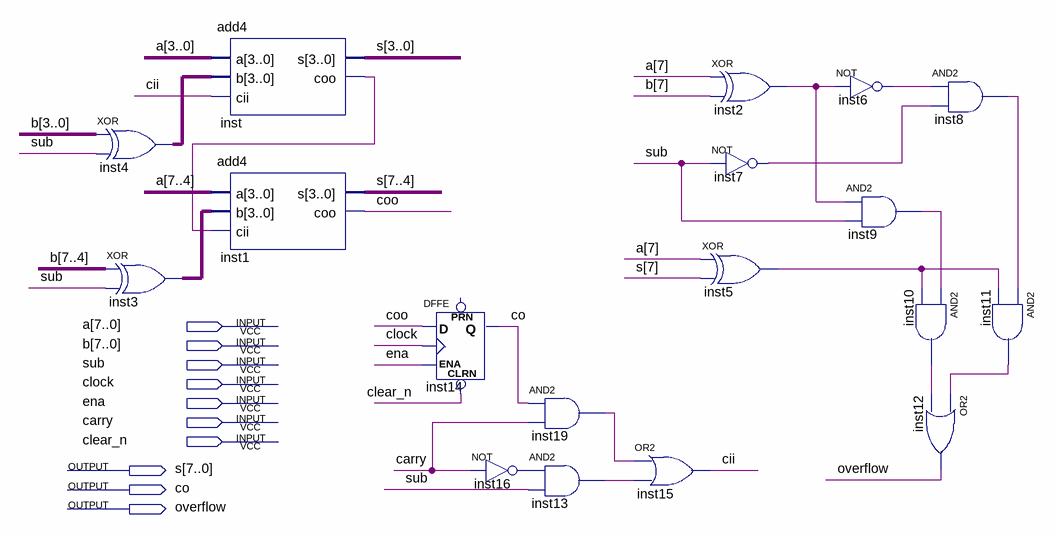
[diagram p0: schematic sheet]
// Quartus schematic addsub_8.bdf as structural Verilog: 18 symbols, 10 pins
module addsub_8 (
  input  [7:0] a,
  input  [7:0] b,
  input  sub,
  input  clock,
  input  ena,
  input  carry,
  input  clear_n,
  output [7:0] s,
  output co,
  output overflow
);

  wire cii, coo, inst2_out, inst5_out, inst6_out, inst7_out, inst8_out, inst9_out, inst10_out, inst11_out,
       inst13_out, inst16_out, inst19_out, inst_coo;
  wire [3:0] inst3_out, inst4_out;

  assign inst4_out = b[3:0] ^ {4{sub}};  // XOR inst4, 4 bits wide
  assign inst3_out = b[7:4] ^ {4{sub}};  // XOR inst3, 4 bits wide
  add4 inst (.a(a[3:0]), .b(inst4_out), .cii(cii), .s(s[3:0]), .coo(inst_coo));
  add4 inst1 (.a(a[7:4]), .b(inst3_out), .cii(inst_coo), .s(s[7:4]), .coo(coo));
  DFFE inst14 (.CLRN(clear_n), .D(coo), .CLK(clock), .ENA(ena), .Q(co));  // open: PRN
  not inst16 (inst16_out, carry);
  and inst19 (inst19_out, co, carry);
  and inst13 (inst13_out, inst16_out, sub);
  or inst15 (cii, inst19_out, inst13_out);
  xor inst2 (inst2_out, a[7], b[7]);
  not inst7 (inst7_out, sub);
  xor inst5 (inst5_out, a[7], s[7]);
  not inst6 (inst6_out, inst2_out);
  and inst9 (inst9_out, inst2_out, sub);
  and inst8 (inst8_out, inst6_out, inst7_out);
  and inst10 (inst10_out, inst9_out, inst5_out);
  or inst12 (overflow, inst11_out, inst10_out);
  and inst11 (inst11_out, inst8_out, inst5_out);
endmodule
